# Altium schematic sheet LEDs.SchDoc
size A
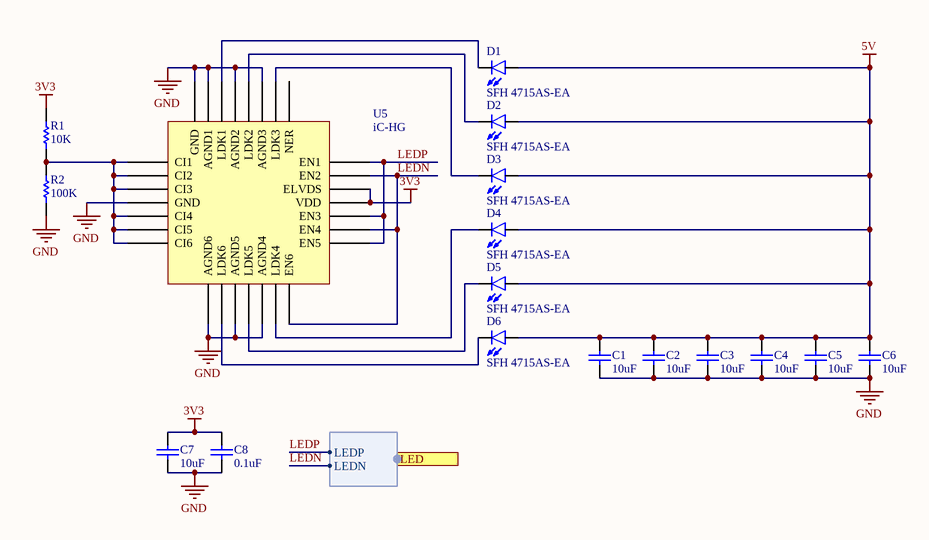
[diagram p0: LEDs.SchDoc]

## Parts
C1  value 10uF  [C0402[1005X55]]  (hidden comment: 10uF 6.3V 0402)
C2  value 10uF  [C0402[1005X55]]  (hidden comment: 10uF 6.3V 0402)
C3  value 10uF  [C0402[1005X55]]  (hidden comment: 10uF 6.3V 0402)
C4  value 10uF  [C0402[1005X55]]  (hidden comment: 10uF 6.3V 0402)
C5  value 10uF  [C0402[1005X55]]  (hidden comment: 10uF 6.3V 0402)
C6  value 10uF  [C0402[1005X55]]  (hidden comment: 10uF 6.3V 0402)
C7  value 10uF  [C0402[1005X55]]  (hidden comment: 10uF 6.3V 0402)
C8  value 0.1uF  [C0402[1005X55]]  (hidden comment: 0.1uF 6.3V 0402)
D1  SFH 4715AS-EA  [SFH 4715AS]
D2  SFH 4715AS-EA  [SFH 4715AS]
D3  SFH 4715AS-EA  [SFH 4715AS]
D4  SFH 4715AS-EA  [SFH 4715AS]
D5  SFH 4715AS-EA  [SFH 4715AS]
D6  SFH 4715AS-EA  [SFH 4715AS]
R1  value 10K  [R0402[1005]]  (hidden comment: 10K 1% 0402)
R2  value 100K  [R0402[1005]]  (hidden comment: 100K 1% 0402)
U5  iC-HG  [QFN-28]

## Ports
LED (harness LED)

## Harnesses
LED: LEDP, LEDN

## Nets
3V3: C7.2 C8.2 R1.2 U5.18(VDD) U5.19(ELVDS)
5V: C1.2 C2.2 C3.2 C4.2 C5.2 C6.2 D1.A D2.A D3.A D4.A D5.A D6.A
GND: C1.1 C2.1 C3.1 C4.1 C5.1 C6.1 C7.1 C8.1 R2.1 U5.4(GND) U5.8(AGND6) U5.10(AGND5) U5.12(AGND4) U5.24(AGND3) U5.26(AGND2) U5.28(AGND1) U5.29(GND)
LEDN: U5.14(EN6) U5.16(EN4) U5.20(EN2) ; port LED.LEDN
LEDP: U5.15(EN5) U5.17(EN3) U5.21(EN1) ; port LED.LEDP
NetD1_C: D1.C U5.27(LDK1)
NetD2_C: D2.C U5.25(LDK2)
NetD3_C: D3.C U5.23(LDK3)
NetD4_C: D4.C U5.13(LDK4)
NetD5_C: D5.C U5.11(LDK5)
NetD6_C: D6.C U5.9(LDK6)
NetR1_1: R1.1 R2.2 U5.1(CI1) U5.2(CI2) U5.3(CI3) U5.5(CI4) U5.6(CI5) U5.7(CI6)

Not connected (* = marked no-connect by the designer): U5 22(NER)

## Library data of the parts
C1-C7 = CAP_10uF_6.3V_0402_20%: 10uF 6.3V 20% 0402 (1005 Metric); PartNumber: GRM155R60J106ME44D; Manufacturer: Murata; Mounting Technology: Surface Mount; PackageReference: 0402; PackageDescription: 0402 (1005 Metric); Voltage: 6.3V; Tolerance: 20%
C8 = CAP_0.1uF_6.3V_0402_10%: 0.1uF 6.3V 10% 0402 (1005 Metric); PartNumber: GRM155R70J104KA01D; Manufacturer: Murata; Mounting Technology: Surface Mount; PackageReference: 0402; PackageDescription: 0402 (1005 Metric); Voltage: 6.3V; Tolerance: 10%
D1-D6 = SFH 4715AS-EA: Manufacturer: Osram; PartNumber: SFH 4715AS-EA; Mounting Technology: Surface Mount; Package Reference: SMD-3
R1 = RES_10K_0402_1%: 10K 0.063W 1% 0402 (1005 Metric); Manufacturer: KOA Speer; PartNumber: RK73H1ETTP1002F; Tolerance: 1%; Power: 0.063W; Mounting Technology: Surface Mount; PackageReference: 0402; PackageDescription: 0402 (1005 Metric); ComponentLink1Description: Datasheet; ComponentLink1URL: http://www.koaspeer.com/catimages/Products/RK73H/RK73H.pdf
R2 = RES_100K_0402_1%: 100K 0.063W 1% 0402 (1005 Metric); Manufacturer: KOA Speer; PartNumber: RK73H1ETTP1003F; Tolerance: 1%; Power: 0.063W; Mounting Technology: Surface Mount; PackageReference: 0402; PackageDescription: 0402 (1005 Metric); ComponentLink1Description: Datasheet; ComponentLink1URL: http://www.koaspeer.com/catimages/Products/RK73H/RK73H.pdf
U5 = iC-HG QFN28-5x5: Manufacturer: iC-Haus; PartNumber: iC-HG QFN28-5x5; Mounting Technology: Surface Mount; PackageReference: QFN-28